# Altium schematic sheet 12.SchDoc
size 420 x 297 mm
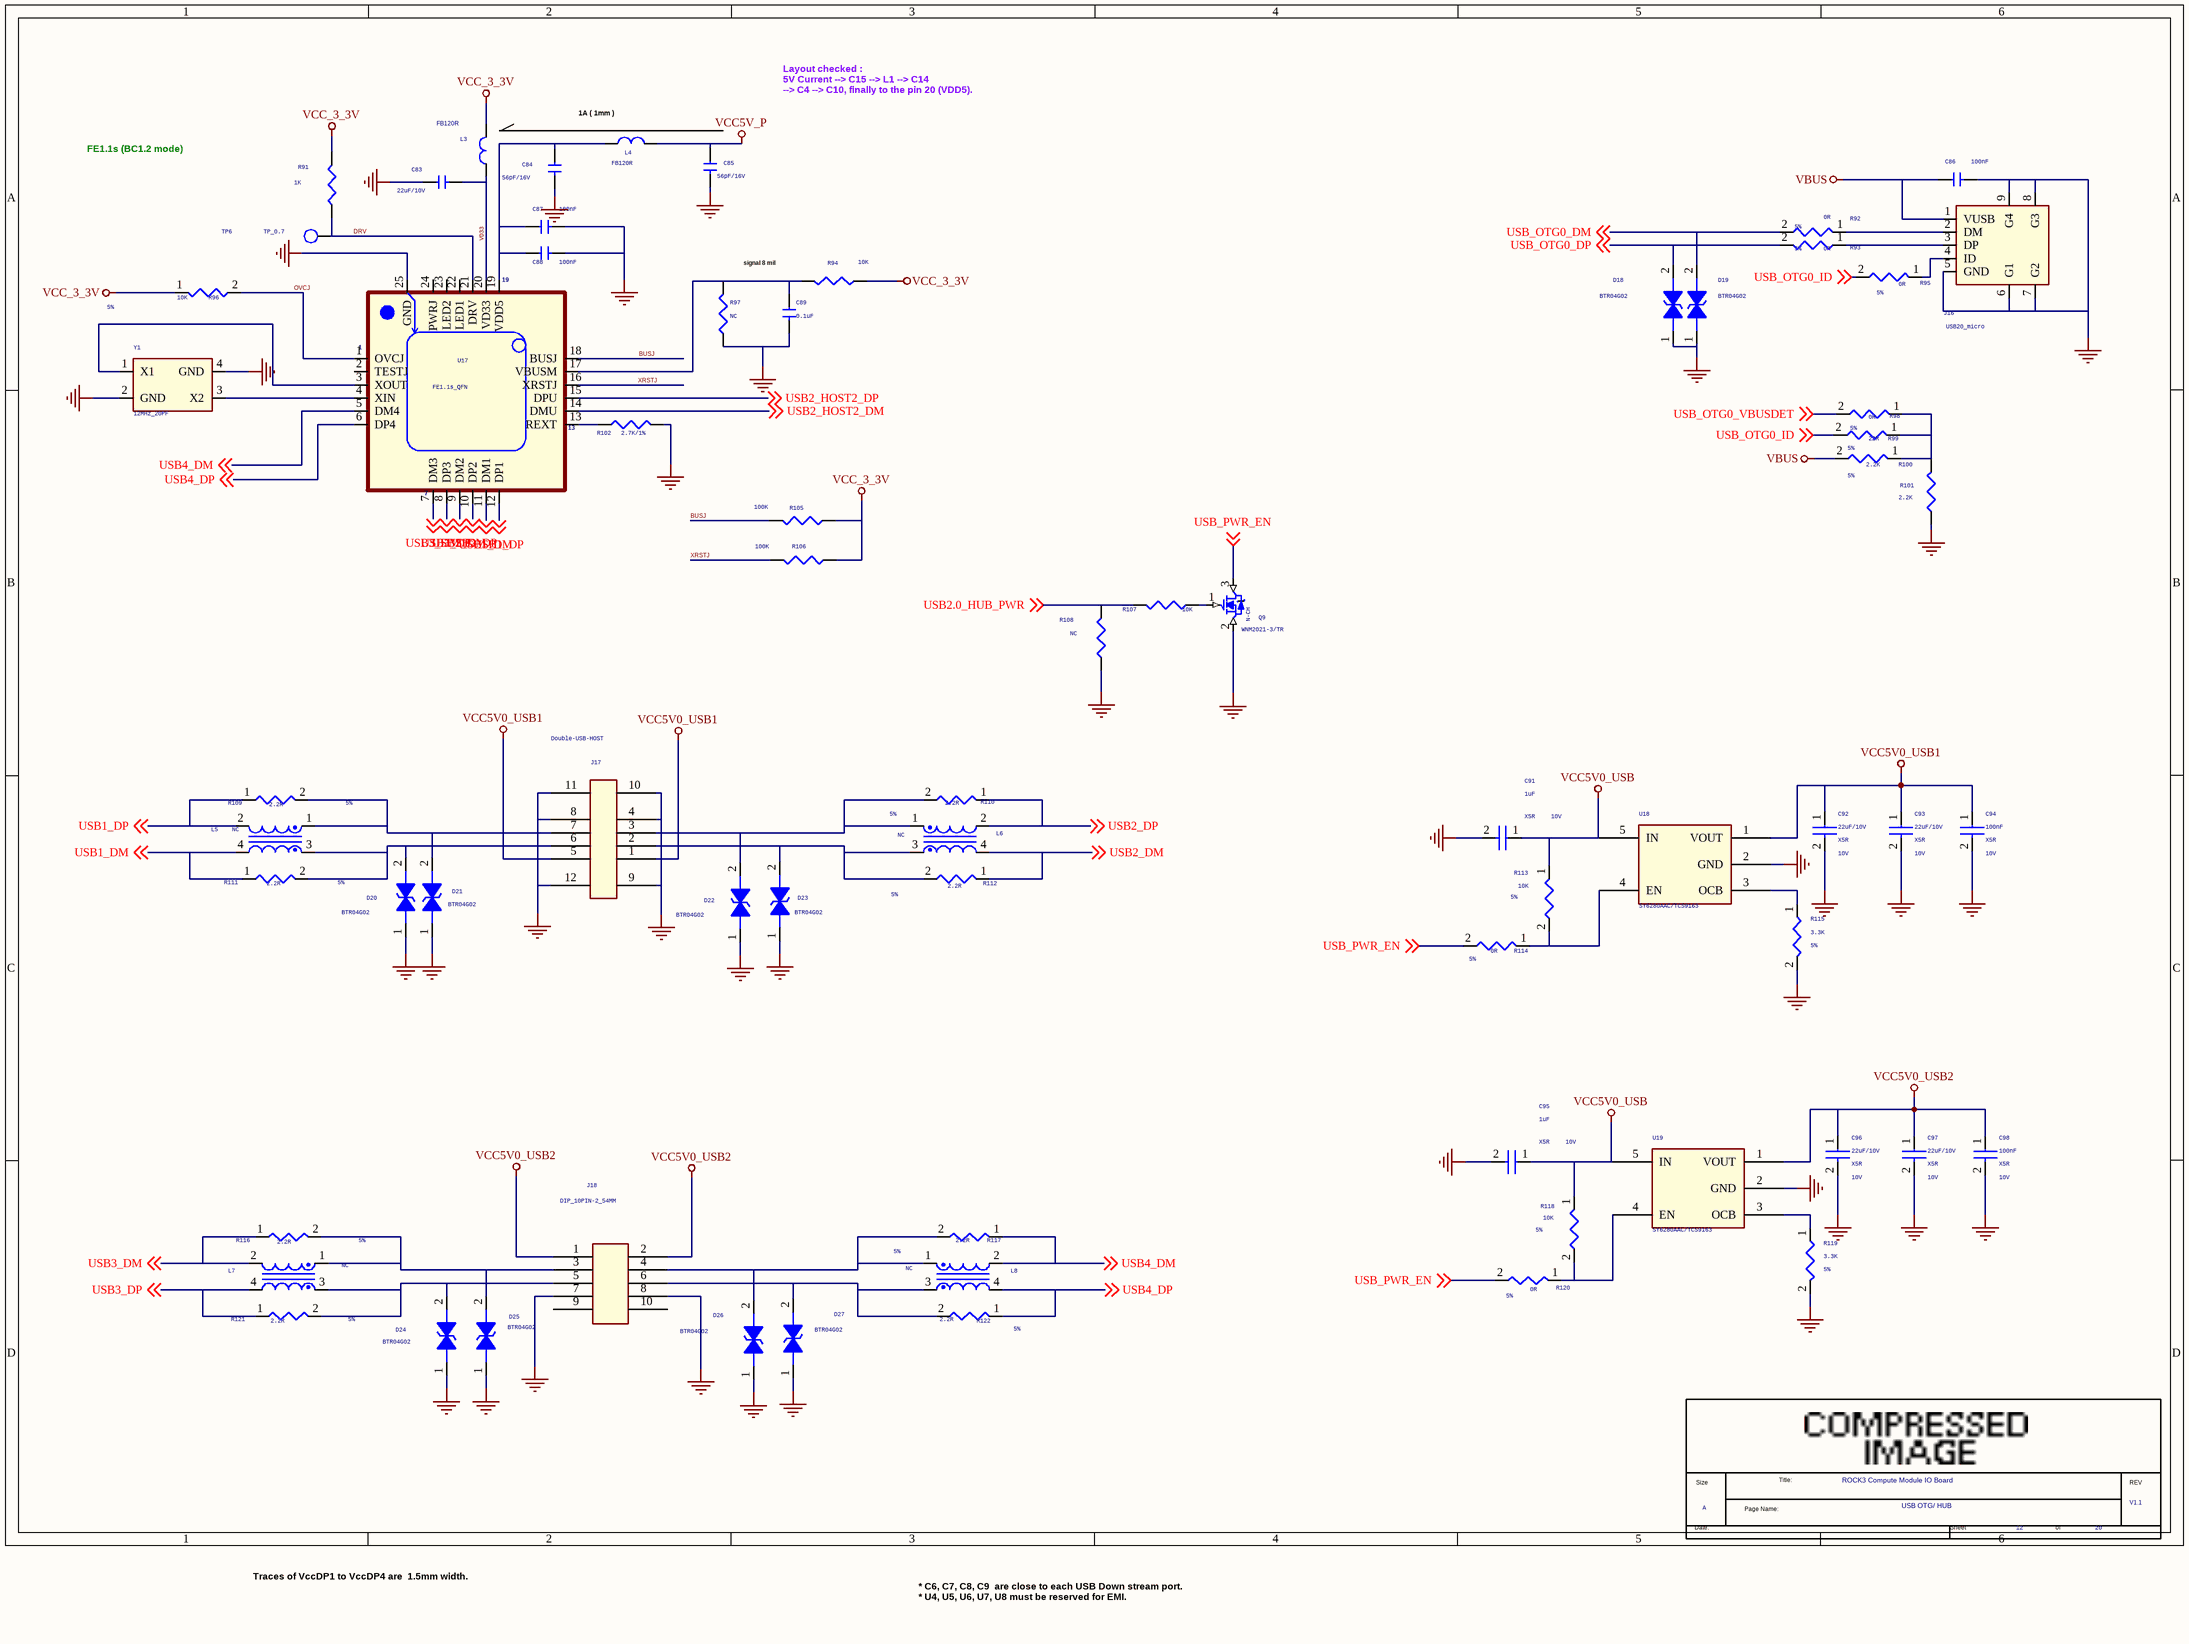
[diagram p0: 12.SchDoc]

## Parts
*  Page Count: 20  Page Number: 12  Page Size: A  Title: ROCK3 Compute Module IO Board  RevCode: V1.1  Doc: USB OTG/ HUB  (hidden comment: radxa_gong)  (graphical)
C83  22uF/10V  [C0603]
C84  56pF/16V  [C0603]
C85  56pF/16V  [C0603]
C86  100nF  [C0603]
C87  100nF  [C0603]
C88  100nF  [C0603]
C89  0.1uF  [C0603]
C91  1uF  Voltage: 10V  Dielectric: X5R  [C0402]
C92  22uF/10V  Voltage: 10V  Dielectric: X5R  [C0603]
C93  22uF/10V  Voltage: 10V  Dielectric: X5R  [C0603]
C94  100nF  Voltage: 10V  Dielectric: X5R  [C0402]
C95  1uF  Voltage: 10V  Dielectric: X5R  [C0402]
C96  22uF/10V  Voltage: 10V  Dielectric: X5R  [C0603]
C97  22uF/10V  Voltage: 10V  Dielectric: X5R  [C0603]
C98  100nF  Voltage: 10V  Dielectric: X5R  [C0402]
D18  BTR04G02  [ESD0402_1xD5]
D19  BTR04G02  [ESD0402_1xD5]
D20  BTR04G02  [ESD0402_1xD5]
D21  BTR04G02  [ESD0402_1xD5]
D22  BTR04G02  [ESD0402_1xD5]
D23  BTR04G02  [ESD0402_1xD5]
D24  BTR04G02  [ESD0402_1xD5]
D25  BTR04G02  [ESD0402_1xD5]
D26  BTR04G02  [ESD0402_1xD5]
D27  BTR04G02  [ESD0402_1xD5]
J16  USB20_micro  [USB-5PAA]
J17  Double-USB-HOST  [USB_DUAL]
J18  DIP_10PIN-2_54MM  [DIP_10PIN-2_54MM]
L3  FB120R  [R0402]
L4  FB120R  [L0402]
L5  NC  [L0402D]
L6  NC  [L0402D]
L7  NC  [L0402D]
L8  NC  [L0402D]
Q9  WNM2021-3/TR  [S0T-23]
R91  1K  [R0603]
R92  0R  Tolerance: 5%  [R0402]
R93  0R  Tolerance: 5%  [R0402]
R94  10K  [R0603]
R95  0R  Tolerance: 5%  [R0402]
R96  10K  Tolerance: 5%  [R0402]
R97  NC  [R0603]
R98  0R  Tolerance: 5%  [R0402]
R99  22R  Tolerance: 5%  [R0402]
R100  2.2K  Tolerance: 5%  [R0402]
R101  2.2K  [R0603]
R102  2.7K/1%  [R0603]
R105  100K  [R0603]
R106  100K  [R0603]
R107  10K  [R0402]
R108  NC  [R0402]
R109  2.2R  Tolerance: 5%  [R0402]
R110  2.2R  Tolerance: 5%  [R0402]
R111  2.2R  Tolerance: 5%  [R0402]
R112  2.2R  Tolerance: 5%  [R0402]
R113  10K  Tolerance: 5%  [R0402]
R114  0R  Tolerance: 5%  [R0402]
R115  3.3K  Tolerance: 5%  [R0402]
R116  2.2R  Tolerance: 5%  [R0402]
R117  2.2R  Tolerance: 5%  [R0402]
R118  10K  Tolerance: 5%  [R0402]
R119  3.3K  Tolerance: 5%  [R0402]
R120  0R  Tolerance: 5%  [R0402]
R121  2.2R  Tolerance: 5%  [R0402]
R122  2.2R  Tolerance: 5%  [R0402]
TP6  TP_0.7  [TEST]
U17  FE1.1s_QFN  [QFN24]
U18  SY6280AAC/TCS9163  [SOT_23_5]
U19  SY6280AAC/TCS9163  [SOT_23_5]
Y1  12MHz_20PF  [CRY-3225]

## Nets
GND: C83.1 C84.2 C85.2 C86.2 C87.2 C88.2 C89.2 C91.2 C92.2 C93.2 C94.2 C95.2 C96.2 C97.2 C98.2 D18.1 D19.1 D20.1 D21.1 D22.1 D23.1 D24.1 D25.1 D26.1 D27.1 J16.5(GND) J16.6(G1) J16.7(G2) J16.8(G3) J16.9(G4) J17.4 J17.8 J17.9 J17.10 J17.11 J17.12 J18.7 J18.8 Q9.2(S) R97.1 R101.2 R102.2 R108.2 R115.2 R119.2 U17.25(GND) U18.2(GND) U19.2(GND) Y1.2(GND) Y1.4(GND)
VBUS: C86.1 J16.1(VUSB) R100.2
VCC5V0_USB: C91.1 C95.1 R113.1 R118.1 U18.5(IN) U19.5(IN)
VCC5V0_USB1: C92.1 C93.1 C94.1 J17.1 J17.5 U18.1(VOUT)
VCC5V0_USB2: C96.1 C97.1 C98.1 J18.1 J18.2 U19.1(VOUT)
VCC5V_P: C85.1 L4.1
VCC_3_3V: L3.2 R91.1 R94.1 R96.1 R105.1 R106.1
BUSJ: R105.2 U17.18(BUSJ)
DRV: R91.2 TP6.1 U17.21(DRV)
OVCJ: R96.2 U17.1(OVCJ)
USB1_DM: L5.4 R111.1 U17.11(DM1) ; off-sheet USB1_DM
USB1_DP: L5.2 R109.1 U17.12(DP1) ; off-sheet USB1_DP
USB2.0_HUB_PWR: R107.2 R108.1 ; off-sheet USB2.0_HUB_PWR
USB2_DM: L6.4 R112.1 U17.9(DM2) ; off-sheet USB2_DM
USB2_DP: L6.2 R110.1 U17.10(DP2) ; off-sheet USB2_DP
USB2_HOST2_DM: U17.14(DMU) ; off-sheet USB2_HOST2_DM
USB2_HOST2_DP: U17.15(DPU) ; off-sheet USB2_HOST2_DP
USB3_DM: L7.2 R116.1 U17.7(DM3) ; off-sheet USB3_DM
USB3_DP: L7.4 R121.1 U17.8(DP3) ; off-sheet USB3_DP
USB4_DM: L8.2 R117.1 U17.5(DM4) ; off-sheet USB4_DM
USB4_DP: L8.4 R122.1 U17.6(DP4) ; off-sheet USB4_DP
USB_OTG0_DM: D19.2 R92.2 ; off-sheet USB_OTG0_DM
USB_OTG0_DP: D18.2 R93.2 ; off-sheet USB_OTG0_DP
USB_OTG0_ID: R95.2 R99.2 ; off-sheet USB_OTG0_ID
USB_OTG0_VBUSDET: R98.2 ; off-sheet USB_OTG0_VBUSDET
USB_PWR_EN: Q9.3(D) R114.2 R120.2 ; off-sheet USB_PWR_EN
VD33: C83.2 L3.1 U17.20(VD33)
XRSTJ: R106.2 U17.16(XRSTJ)
NetC84_1: C84.1 C87.1 C88.1 L4.2 U17.19(VDD5)
NetC89_1: C89.1 R94.2 R97.2 U17.17(VBUSM)
NetD20_2: D20.2 J17.6 L5.3 R111.2
NetD21_2: D21.2 J17.7 L5.1 R109.2
NetD22_2: D22.2 J17.3 L6.1 R110.2
NetD23_2: D23.2 J17.2 L6.3 R112.2
NetD24_2: D24.2 J18.5 L7.3 R121.2
NetD25_2: D25.2 J18.3 L7.1 R116.2
NetD26_2: D26.2 J18.4 L8.1 R117.2
NetD27_2: D27.2 J18.6 L8.3 R122.2
NetJ16_2: J16.2(DM) R92.1
NetJ16_3: J16.3(DP) R93.1
NetJ16_4: J16.4(ID) R95.1
NetQ9_1: Q9.1(G) R107.1
NetR98_1: R98.1 R99.1 R100.1 R101.1
NetR102_1: R102.1 U17.13(REXT)
NetR113_2: R113.2 R114.1 U18.4(EN)
NetR115_1: R115.1 U18.3(OCB)
NetR118_2: R118.2 R120.1 U19.4(EN)
NetR119_1: R119.1 U19.3(OCB)
NetU17_3: U17.3(XOUT) Y1.1(X1)
NetU17_4: U17.4(XIN) Y1.3(X2)

Not connected (* = marked no-connect by the designer): J18 9 10; U17 2(TESTJ) 22(LED1) 23(LED2) 24(PWRJ)

## Notes on the sheet
- Layout checked :
  5V Current --> C15 --> L1 --> C14
  --> C4 --> C10, finally to the pin 20 (VDD5).
- (near L4) 1A ( 1mm )
- FE1.1s (BC1.2 mode)
- signal 8 mil
- Traces of VccDP1 to VccDP4 are  1.5mm width.
- * C6, C7, C8, C9  are close to each USB Down stream port.
  * U4, U5, U6, U7, U8 must be reserved for EMI.
- (in symbol N-MOSFET) N-CH
- (in symbol radxa_gong) Size; Title:; REV; Page Name:; Date:; Sheet; of

## Library data of the parts
C83-C89 = CAP_0.1uF_0603
C91 C95 = CAP NP_Dup2: cap,1.00uF,+/-10%,10V,X5R,C0402; Manufacturer PN: C1005X5R1A105K050BB; Manufacturer: TDK; Tolerance: 10%; C_Voltage: 6.3V; Priority: A; Created by: JJJ; Part Type: C0402; RK PN: C1005X5R1A105K050BB
C92 C93 C96 C97 = CAP NP_Dup2: cap,100.00nF,+/-10%,10V,X5R,C0402; Manufacturer PN: C1005X5R1A104K050BA; Manufacturer: TDK; Tolerance: 10%; Priority: A; Created by: JJJ; Part Type: C0402; RK PN: C1005X5R1A104K050BA
C94 C98 = CAP NP_Dup2: cap,100.00nF,+/-10%,10V,X5R,C0402; Manufacturer: TDK; RK PN: C1005X5R1A104K050BA; Priority: A; Tolerance: 10%; Part Type: C0402; Manufacturer PN: C1005X5R1A104K050BA; Created by: JJJ
D18 D23 D26 = DIODE BI_DIR TRIG: 1-Line, Bi-directional, Transient Voltage Suppressors.17.5pF.; Manufacturer: WillSemi(韦尔半导体); RK PN: ESD5451N; Priority: A; OPTION: DNP; Part Type: ESD_TVS; Manufacturer PN: ESD5451N; Created by: JJJ
D19-D22 D24 D25 D27 = DIODE BI_DIR TRIG: 1-Line, Bi-directional, Transient Voltage Suppressors.17.5pF.; Manufacturer PN: ESD5451N; Manufacturer: WillSemi(韦尔半导体); OPTION: DNP; Priority: A; Created by: JJJ; Part Type: ESD_TVS; RK PN: ESD5451N
J16 = USB20_MICRO: micro型USB2.0座，卧式，贴焊; Manufacturer: 祺华电子; Priority: A; RK PN: USB20_micro; Part Type: USB Jack; Manufacturer Part Number: USB20_micro; Created by: JJJ
J17 = CON4_0_Dup1
J18 = CON4_0
L3 L4 = CHOKE RF
L5-L8 = INDUCTOR COM: Winding Type Common Mode Choke Coil; Manufacturer: sunlord; RK PN: SDCW2012-2-900TF; Priority: A; DC Resistor: 0.35ohm; Tolerance: 25%; Irms: 330mA; Resonace frequency: 90R@100M; Part Type: IND; Manufacturer PN: SDCW2012-2-900TF; Created by: JJJ
Q9 = N-MOSFET: SANZ_P/N: SK2300; Part Type: MOS管
R91 R94 R97 R101 R102 R105 R106 = RES_0603
R92 R95 R98 R100 R109 R111 R114 R120-R122 = RESISTOR_Dup1: 通用厚膜电阻,0R,+/-5%,R0402,1/16W.; Manufacturer: YAGEO; RK PN: RC0402JR-070RL; Priority: A; Wattage: 1/16W; Part Type: 通用厚膜电阻; Manufacturer PN: RC0402JR-070RL; Created by: YTL
R93 R99 R110 R112 R116 R117 = RESISTOR_Dup1: 通用厚膜电阻,0R,+/-5%,R0402,1/16W.; Manufacturer PN: RC0402JR-070RL; Manufacturer: YAGEO; Wattage: 1/16W; Priority: A; Created by: YTL; Part Type: 通用厚膜电阻; RK PN: RC0402JR-070RL
R96 = RESISTOR_Dup1: 通用厚膜电阻,0R,+/-5%,R0402,1/16W.; Manufacturer PN: RC0402JR-070RL; Manufacturer: YAGEO; option: DNP; Wattage: 1/16W; Priority: A; Created by: YTL; Part Type: 通用厚膜电阻; RK PN: RC0402JR-070RL
R107 = RESISTOR_1: RES,thick film,47KOhm,+/-5%,1/16W,SMD0402
R108 = RESISTOR_0: RES,thick film,47KOhm,+/-5%,1/16W,SMD0402; MARK: 51K
R113 R115 R118 R119 = RESISTOR_Dup1: 通用厚膜电阻,4K7,+/-5%,R0402,1/16W.; Manufacturer PN: RC0402JR-074K7L; Manufacturer: YAGEO; Wattage: 1/16W; Priority: A; Created by: YTL; Part Type: 通用厚膜电阻; RK PN: RC0402JR-074K7L
TP6 = TP: Test Point 0.7mm; RK PN: TESTPOINT_0R7; Priority: A; Part Type: TP; Created by: JJJ
U17 = FE1_1s_B_QFN24_2
U18 U19 = SWITCH_SY6280: Low Loss Power Distribution Switch; Manufacturer: Silergy（矽力杰）; Priority: A; Created by: JJJ; Manufacturer PN: SY6280AAC; Part Type: Switch; RK PN: SY6280AAC
Y1 = CRYSTAL_4P: 无源晶振，25M，3225,±10ppm，10pF，Hosonic; Manufacturer: Hosonic(鸿星电子); RK PN: E3SB25.0000F10E11; Priority: A; Part Type: CRYSTAL; Manufacturer PN: E3SB25.0000F10E11; Created by: JJJ
* = radxa_gong: Page Create Date: March  8, 1995